# EAGLE schematic proc (EAGLE 7.5.0)
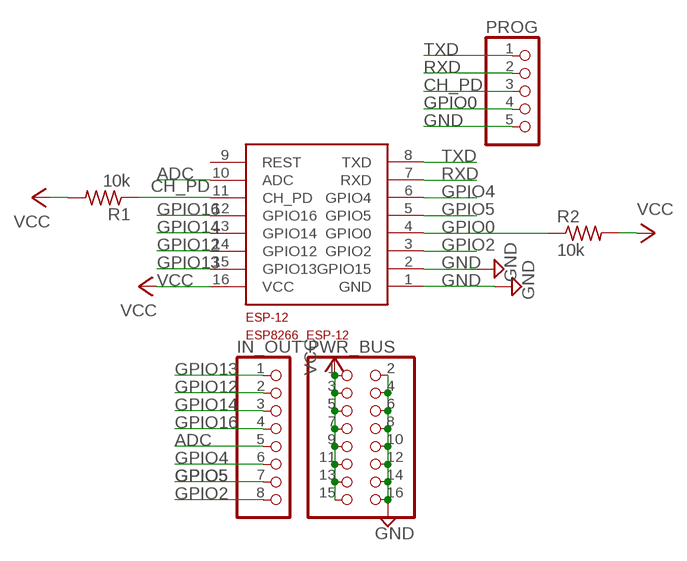
[diagram p0: schematic, sheet 1]

## Parts
ESP-12  ESP8266_ESP-12  [ESP8266-ESP12]
IN_OUT  PINHD-1X8  [1X08]
PROG  PINHD-1X5  [1X05]
PWR_BUS  PINHD-2X8  [2X08]
R1  10k  R-US_M1206  [M1206]
R2  10k  R-US_M1206  [M1206]

## Nets
ADC: ESP-12.10(ADC) IN_OUT.5
CH_PD: ESP-12.11(CH_PD) PROG.3 R1.1
GND: ESP-12.1(GND) ESP-12.2(GPIO15) PROG.5 PWR_BUS.2 PWR_BUS.4 PWR_BUS.6 PWR_BUS.8 PWR_BUS.10 PWR_BUS.12 PWR_BUS.14 PWR_BUS.16
GPIO0: ESP-12.4(GPIO0) PROG.4 R2.1
GPIO2: ESP-12.3(GPIO2) IN_OUT.8
GPIO4: ESP-12.6(GPIO4) IN_OUT.6
GPIO5: ESP-12.5(GPIO5) IN_OUT.7
GPIO12: ESP-12.14(GPIO12) IN_OUT.2
GPIO13: ESP-12.15(GPIO13) IN_OUT.1
GPIO14: ESP-12.13(GPIO14) IN_OUT.3
GPIO16: ESP-12.12(GPIO16) IN_OUT.4
RXD: ESP-12.7(RXD) PROG.2
TXD: ESP-12.8(TXD) PROG.1
VCC: ESP-12.16(VCC) PWR_BUS.1 PWR_BUS.3 PWR_BUS.5 PWR_BUS.7 PWR_BUS.9 PWR_BUS.11 PWR_BUS.13 PWR_BUS.15 R1.2 R2.2
Unconnected: ESP-12.9(REST)

## Library data of the parts
ESP-12 = ESP8266-ESP12:ESP8266_ESP-12
IN_OUT = pinhead:PINHD-1X8: PIN HEADER
PROG = pinhead:PINHD-1X5: PIN HEADER
PWR_BUS = pinhead:PINHD-2X8: PIN HEADER
R1 R2 = rcl:R-US_: RESISTOR, American symbol